# Altium schematic sheet TerminalBlock.SchDoc
size 420 x 297 mm; SheetNumber: 2; SheetTotal: 2
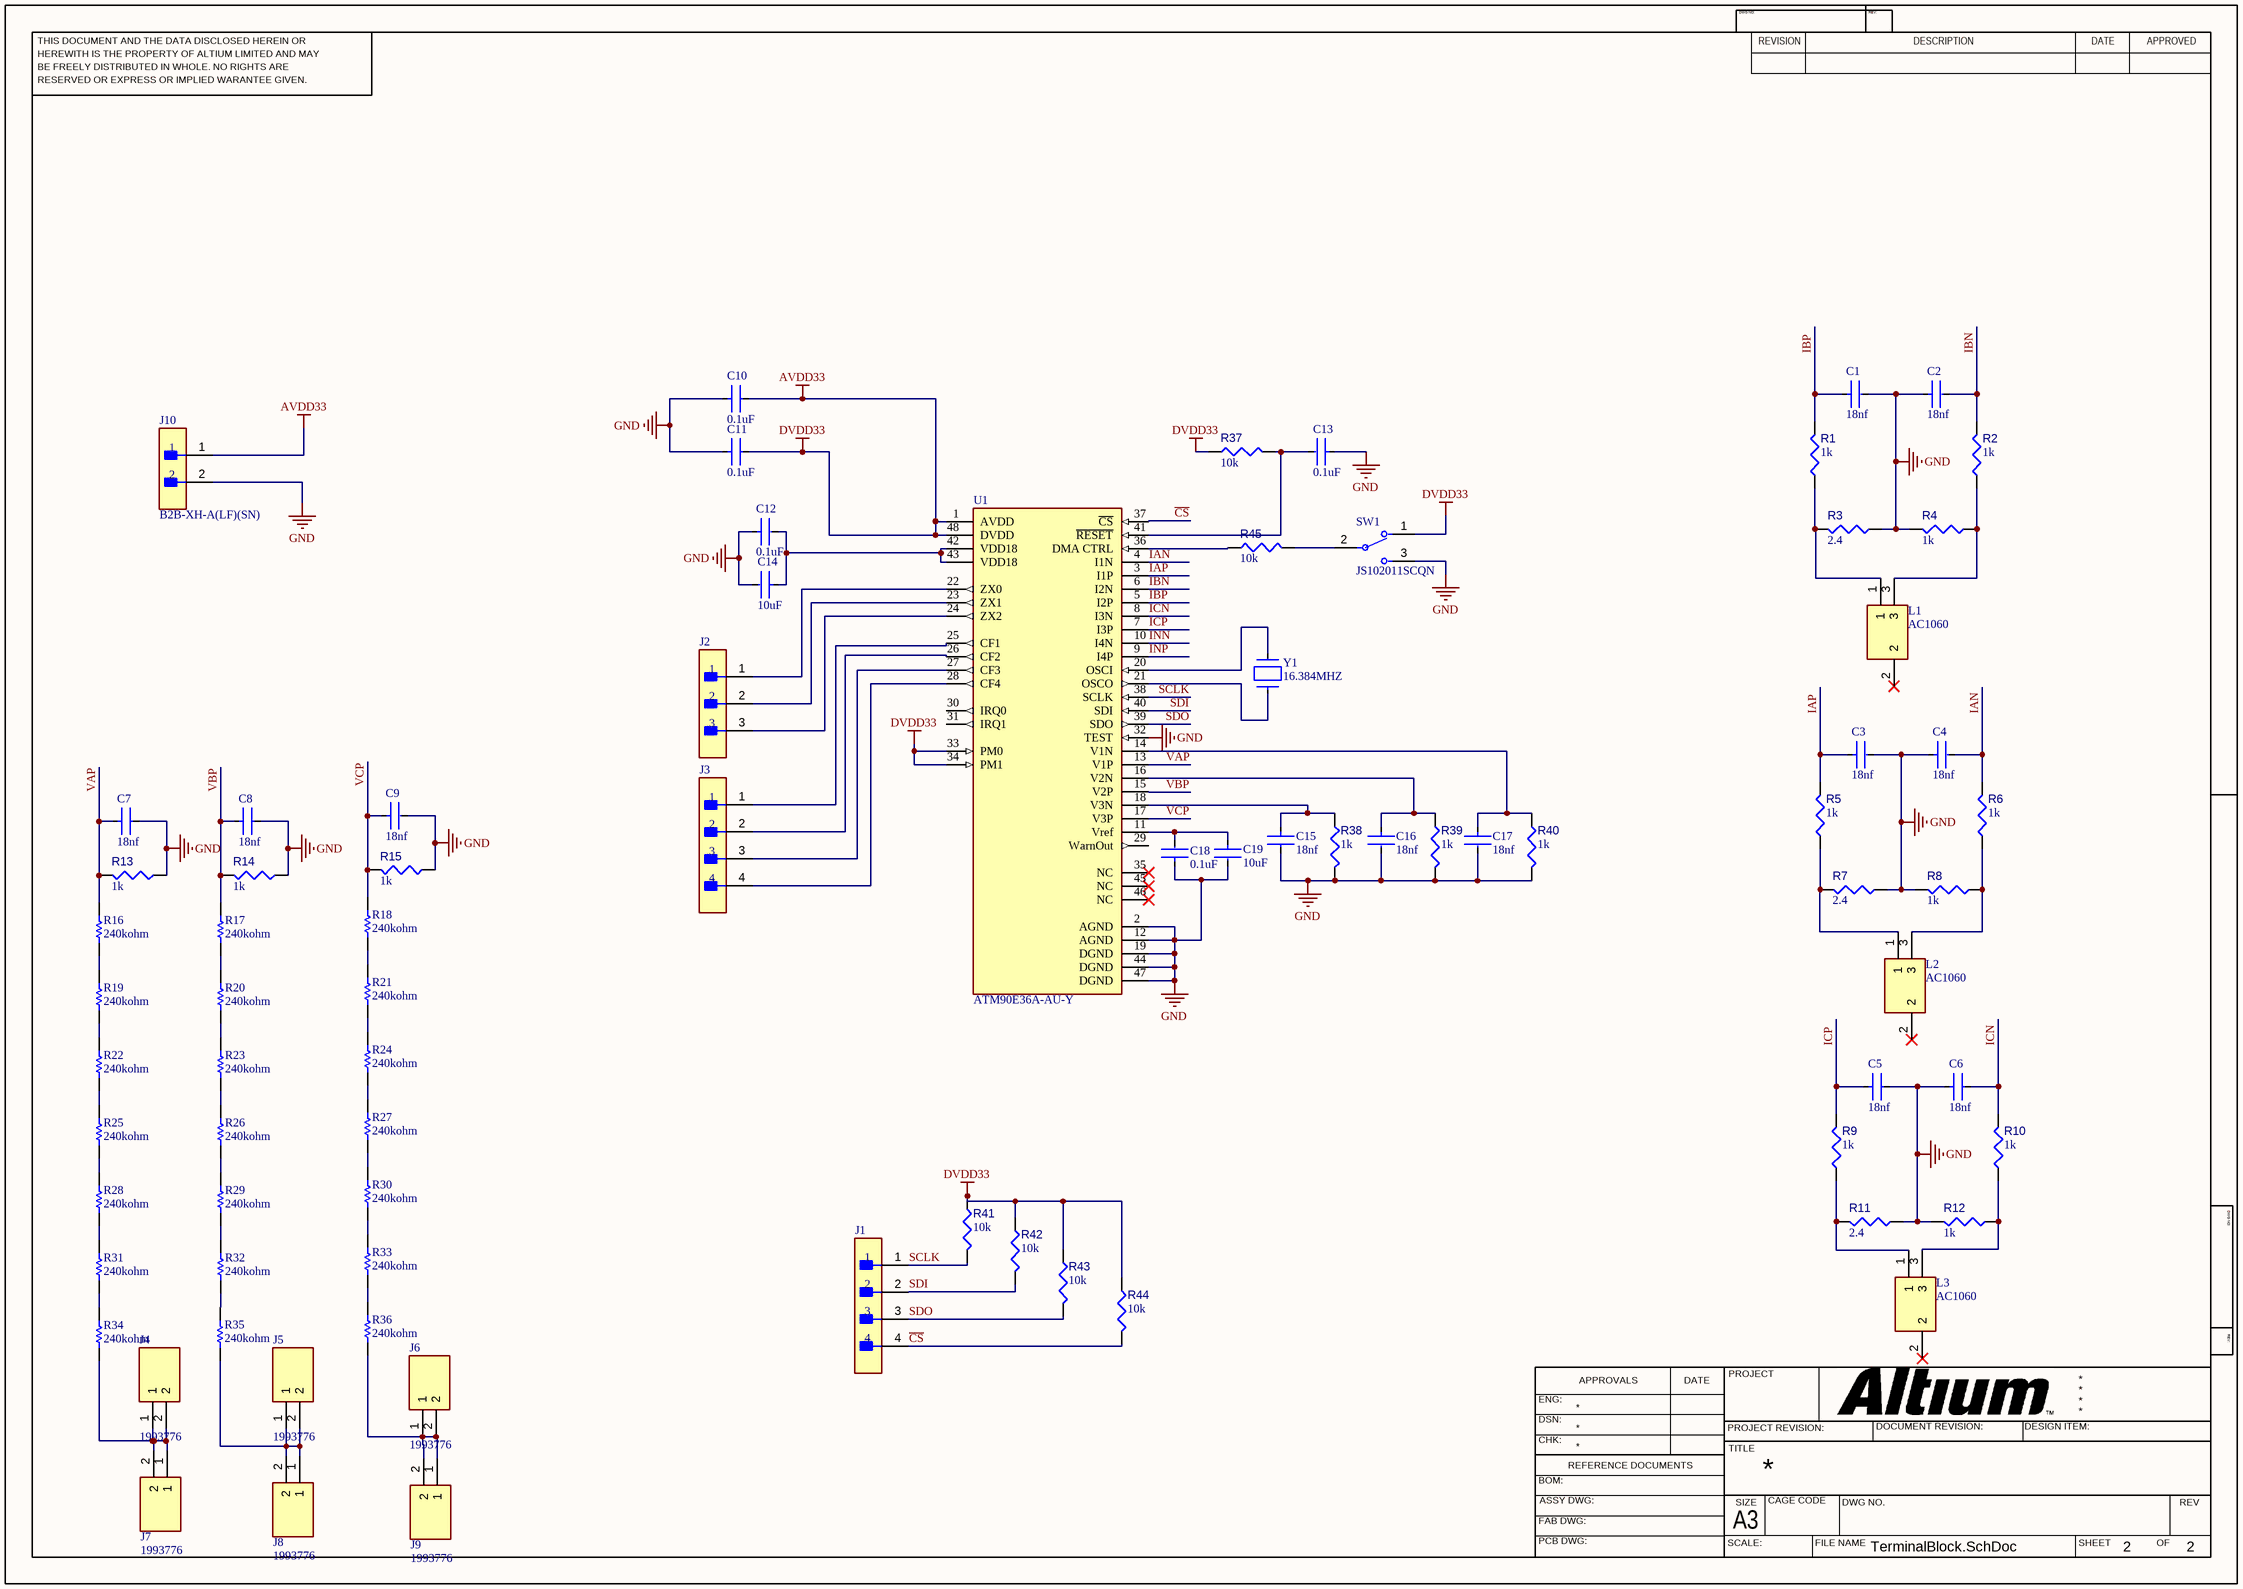
[diagram p0: TerminalBlock.SchDoc]

## Parts
C1  18nf  [FP-C0603C-CF-MFG]
C2  18nf  [FP-C0603C-CF-MFG]
C3  18nf  [FP-C0603C-CF-MFG]
C4  18nf  [FP-C0603C-CF-MFG]
C5  18nf  [FP-C0603C-CF-MFG]
C6  18nf  [FP-C0603C-CF-MFG]
C7  18nf  [FP-C0603C-CF-MFG]
C8  18nf  [FP-C0603C-CF-MFG]
C9  18nf  [FP-C0603C-CF-MFG]
C10  0.1uF  [FP-C0603-CJ-MFG]
C11  0.1uF  [FP-C0603-CJ-MFG]
C12  0.1uF  [FP-C0603-CJ-MFG]
C13  0.1uF  [FP-C0603-CJ-MFG]
C14  10uF  [FP-C0603C106M9PACTU-MFG]
C15  18nf  [FP-C0603C-CF-MFG]
C16  18nf  [FP-C0603C-CF-MFG]
C17  18nf  [FP-C0603C-CF-MFG]
C18  0.1uF  [FP-C0603-CJ-MFG]
C19  10uF  [FP-C0603C106M9PACTU-MFG]
J1  B4B-XH-A(LF)(SN)  [FP-B4B-XH-A_LF_SN-MFG]  (value not drawn)
J2  B3B-XH-A(LF)(SN)  [FP-B3B-XH-A_LF_SN-MFG]  (value not drawn)
J3  B4B-XH-A(LF)(SN)  [FP-B4B-XH-A_LF_SN-MFG]  (value not drawn)
J4  1993776  [1993776]
J5  1993776  [1993776]
J6  1993776  [1993776]
J7  1993776  [1993776]
J8  1993776  [1993776]
J9  1993776  [1993776]
J10  B2B-XH-A(LF)(SN)  [FP-B2B-XH-A_LF_SN-MFG]
L1  AC1060  [AC1060]
L2  AC1060  [AC1060]
L3  AC1060  [AC1060]
R1  value 1k  [RESC1608X55X25ML10T15]  (hidden comment: Resistor 100k +/-1% 0603 100 mW)
R2  value 1k  [RESC1608X55X25ML10T15]  (hidden comment: Resistor 100k +/-1% 0603 100 mW)
R3  value 2.4  [RESC1608X55X25ML10T15]  (hidden comment: Resistor 100k +/-1% 0603 100 mW)
R4  value 1k  [RESC1608X55X25ML10T15]  (hidden comment: Resistor 100k +/-1% 0603 100 mW)
R5  value 1k  [RESC1608X55X25ML10T15]  (hidden comment: Resistor 100k +/-1% 0603 100 mW)
R6  value 1k  [RESC1608X55X25ML10T15]  (hidden comment: Resistor 100k +/-1% 0603 100 mW)
R7  value 2.4  [RESC1608X55X25ML10T15]  (hidden comment: Resistor 100k +/-1% 0603 100 mW)
R8  value 1k  [RESC1608X55X25ML10T15]  (hidden comment: Resistor 100k +/-1% 0603 100 mW)
R9  value 1k  [RESC1608X55X25ML10T15]  (hidden comment: Resistor 100k +/-1% 0603 100 mW)
R10  value 1k  [RESC1608X55X25ML10T15]  (hidden comment: Resistor 100k +/-1% 0603 100 mW)
R11  value 2.4  [RESC1608X55X25ML10T15]  (hidden comment: Resistor 100k +/-1% 0603 100 mW)
R12  value 1k  [RESC1608X55X25ML10T15]  (hidden comment: Resistor 100k +/-1% 0603 100 mW)
R13  value 1k  [RESC1608X55X25ML10T15]  (hidden comment: Resistor 100k +/-1% 0603 100 mW)
R14  value 1k  [RESC1608X55X25ML10T15]  (hidden comment: Resistor 100k +/-1% 0603 100 mW)
R15  value 1k  [RESC1608X55X25ML10T15]  (hidden comment: Resistor 100k +/-1% 0603 100 mW)
R16  240kohm  [RESC1608X55X30NL20T20]
R17  240kohm  [RESC1608X55X30NL20T20]
R18  240kohm  [RESC1608X55X30NL20T20]
R19  240kohm  [RESC1608X55X30NL20T20]
R20  240kohm  [RESC1608X55X30NL20T20]
R21  240kohm  [RESC1608X55X30NL20T20]
R22  240kohm  [RESC1608X55X30NL20T20]
R23  240kohm  [RESC1608X55X30NL20T20]
R24  240kohm  [RESC1608X55X30NL20T20]
R25  240kohm  [RESC1608X55X30NL20T20]
R26  240kohm  [RESC1608X55X30NL20T20]
R27  240kohm  [RESC1608X55X30NL20T20]
R28  240kohm  [RESC1608X55X30NL20T20]
R29  240kohm  [RESC1608X55X30NL20T20]
R30  240kohm  [RESC1608X55X30NL20T20]
R31  240kohm  [RESC1608X55X30NL20T20]
R32  240kohm  [RESC1608X55X30NL20T20]
R33  240kohm  [RESC1608X55X30NL20T20]
R34  240kohm  [RESC1608X55X30NL20T20]
R35  240kohm  [RESC1608X55X30NL20T20]
R36  240kohm  [RESC1608X55X30NL20T20]
R37  value 10k  [RESC1608X55X25ML10T15]  (hidden comment: Resistor 100k +/-1% 0603 100 mW)
R38  value 1k  [RESC1608X55X25ML10T15]  (hidden comment: Resistor 100k +/-1% 0603 100 mW)
R39  value 1k  [RESC1608X55X25ML10T15]  (hidden comment: Resistor 100k +/-1% 0603 100 mW)
R40  value 1k  [RESC1608X55X25ML10T15]  (hidden comment: Resistor 100k +/-1% 0603 100 mW)
R41  value 10k  [RESC1608X55X25ML10T15]  (hidden comment: Resistor 100k +/-1% 0603 100 mW)
R42  value 10k  [RESC1608X55X25ML10T15]  (hidden comment: Resistor 100k +/-1% 0603 100 mW)
R43  value 10k  [RESC1608X55X25ML10T15]  (hidden comment: Resistor 100k +/-1% 0603 100 mW)
R44  value 10k  [RESC1608X55X25ML10T15]  (hidden comment: Resistor 100k +/-1% 0603 100 mW)
R45  value 10k  [RESC1608X55X25ML10T15]  (hidden comment: Resistor 100k +/-1% 0603 100 mW)
SW1  JS102011SCQN  [FP-JS102011SCQN-MFG]
U1  ATM90E36A-AU-Y  [FP-ATM90E36A-AU-Y-MFG]
Y1  16.384MHZ  [FP-ABM2-MFG]

## Nets
AVDD33: C10.2 C11.2 J10.1 R37.2 R41.2 R42.2 R43.2 R44.2 SW1.1 U1.1(AVDD) U1.33(PM0) U1.34(PM1) U1.48(DVDD)  [also labelled DVDD33]
GND: C1.2 C2.1 C3.2 C4.1 C5.2 C6.1 C7.2 C8.2 C9.2 C10.1 C11.1 C12.1 C13.1 C14.2 C15.2 C16.2 C17.2 C18.1 C19.2 J10.2 R3.1 R4.2 R7.1 R8.2 R11.1 R12.2 R13.1 R14.1 R15.1 R38.1 R39.1 R40.1 SW1.3 U1.2(AGND) U1.12(AGND) U1.19(DGND) U1.32(TEST) U1.44(DGND) U1.47(DGND)
~{CS}: J1.4 R44.1 U1.37(~{CS})
IAN: C4.2 R6.2 U1.4(I1N)
IAP: C3.1 R5.2 U1.3(I1P)
IBN: C2.2 R2.2 U1.6(I2N)
IBP: C1.1 R1.2 U1.5(I2P)
ICN: C6.2 R10.2 U1.8(I3N)
ICP: C5.1 R9.2 U1.7(I3P)
INN: U1.10(I4N)
INP: U1.9(I4P)
SCLK: J1.1 R41.1 U1.38(SCLK)
SDI: J1.2 R42.1 U1.40(SDI)
SDO: J1.3 R43.1 U1.39(SDO)
VAP: C7.1 R13.2 R16.2 U1.13(V1P)
VBP: C8.1 R14.2 R17.2 U1.15(V2P)
VCP: C9.1 R15.2 R18.2 U1.17(V3P)
NetC12_2: C12.2 C14.1 U1.42(VDD18) U1.43(VDD18)
NetC13_2: C13.2 R37.1 U1.41(~{RESET})
NetC15_1: C15.1 R38.2 U1.18(V3N)
NetC16_1: C16.1 R39.2 U1.16(V2N)
NetC17_1: C17.1 R40.2 U1.14(V1N)
NetC18_2: C18.2 C19.1 U1.11(Vref)
NetJ2_1: J2.1 U1.22(ZX0)
NetJ2_2: J2.2 U1.23(ZX1)
NetJ2_3: J2.3 U1.24(ZX2)
NetJ3_1: J3.1 U1.25(CF1)
NetJ3_2: J3.2 U1.26(CF2)
NetJ3_3: J3.3 U1.27(CF3)
NetJ3_4: J3.4 U1.28(CF4)
NetJ4_1: J4.1 J4.2 J7.1 J7.2 R34.1
NetJ5_1: J5.1 J5.2 J8.1 J8.2 R35.1
NetJ6_1: J6.1 J6.2 J9.1 J9.2 R36.1
NetL1_1: L1.1 R1.1 R3.2
NetL1_3: L1.3 R2.1 R4.1
NetL2_1: L2.1 R5.1 R7.2
NetL2_3: L2.3 R6.1 R8.1
NetL3_1: L3.1 R9.1 R11.2
NetL3_3: L3.3 R10.1 R12.1
NetR16_1: R16.1 R19.2
NetR17_1: R17.1 R20.2
NetR18_1: R18.1 R21.2
NetR19_1: R19.1 R22.2
NetR20_1: R20.1 R23.2
NetR21_1: R21.1 R24.2
NetR22_1: R22.1 R25.2
NetR23_1: R23.1 R26.2
NetR24_1: R24.1 R27.2
NetR25_1: R25.1 R28.2
NetR26_1: R26.1 R29.2
NetR27_1: R27.1 R30.2
NetR28_1: R28.1 R31.2
NetR29_1: R29.1 R32.2
NetR30_1: R30.1 R33.2
NetR31_1: R31.1 R34.2
NetR32_1: R32.1 R35.2
NetR33_1: R33.1 R36.2
NetR45_1: R45.1 SW1.2(C)
NetR45_2: R45.2 U1.36(DMA_CTRL)
NetU1_20: U1.20(OSCI) Y1.2
NetU1_21: U1.21(OSCO) Y1.1

Not connected (* = marked no-connect by the designer): L1 2*; L2 2*; L3 2*; U1 29(WarnOut) 30(IRQ0) 31(IRQ1) 35(NC)* 45(NC)* 46(NC)*

## Notes on the sheet
- THIS DOCUMENT AND THE DATA DISCLOSED HEREIN OR
- HEREWITH IS THE PROPERTY OF ALTIUM LIMITED AND MAY
- DWG NO:
- REVISION
- REV:
- DESCRIPTION
- DATE
- APPROVED
- BE FREELY DISTRIBUTED IN WHOLE. NO RIGHTS ARE
- RESERVED OR EXPRESS OR IMPLIED WARANTEE GIVEN.
- ENG:
- APPROVALS
- PROJECT
- DSN:
- CHK:
- REFERENCE DOCUMENTS
- PROJECT REVISION:
- TITLE
- DOCUMENT REVISION:
- DESIGN ITEM:
- BOM:
- FAB DWG:
- PCB DWG:
- ASSY DWG:
- SCALE:
- A3
- SIZE
- CAGE CODE
- FILE NAME
- DWG NO.
- SHEET
- OF
- REV

## Library data of the parts
C1-C9 C15-C17 = CMP-1035-02403-3: CAP CER 0.018UF 50V 10% X7R 0603; Manufacturer: KEMET; Manufacturer Part Number: C0603C183K5RACTU; Material: Ceramic; Tolerance: 0.1; Capacitance: 18,000 pF; Temperature Coefficient: 30ppm/°C; Value: 18,000 pF; Automotive Grade: Grade 1; Device Class L3: Ceramic Capacitors; Temperature Characteristic: X7R; ComponentLink2Description: Datasheet; RoHS: TRUE; Package: C0603C-CF; Automotive: Yes; Octopart: https://octopart.com/c0603c183k5ractu-kemet-9138582; Temperature Range Low: -55°C; Height: 0.87mm; Mouser Description: Multilayer Ceramic Capacitors MLCC - SMD/SMT 50volts 18000pF X7R 10%; Temperature: -55°C to +125°C; Digikey Description: CAP CER 0.018UF 50V 10% X7R 0603; Device Class L2: Capacitors; Device Class L1: Passive Components; Temperature Range High: +125°C; Category: Cap; ComponentLink2URL: https://api.kemet.com/component-edge/download/datasheet/C0603C100J5GACAUTO.pdf; Lead Free: Yes; Voltage Rating: 50 V
C10-C13 C18 = CMP-2006-03300-2: CAP CER 0.1UF 50V X7R 0603; Manufacturer Part Number: C0603X104K5RACTU; Manufacturer: Kemet; Capacitance: 100nF; Material: Ceramic; Tolerance: 10%; Value: 100nF; Temperature Coefficient: 15%; Temperature Range High: +125°C; Temperature Range Low: -55°C; Voltage: 50V; ComponentLink2Description: Datasheet; RoHS: TRUE; ComponentLink2URL: https://content.kemet.com/datasheets/KEM_C1013_X7R_FT-CAP_SMD.pdf; Device Class L3: Ceramic Capacitors; Device Class L2: Capacitors; Package: C0603-CJ; Height: 0.95mm; Device Class L1: Passive Components; Temperature Characteristic: X7R; Lead Free: Yes; Digikey Description: CAP CER 0.1UF 50V X7R 0603; Automotive: No; Mouser Description: Capacitor; Ceramic; Cap 0.1uF; Tol+10%; SMT; Flexible Termination; Vol-Rtg 50V; TR; Temperature: -55°C to +125°C; Octopart: https://octopart.com/c0603x104k5ractu-kemet-9145062; Category: Cap; Voltage Rating: 50V; Ipc Land Pattern Name: CAPC16080X80
C14 C19 = CMP-2006-02285-3: CAP CER 10UF 6.3V X5R 0603; Manufacturer Part Number: C0603C106M9PACTU; Manufacturer: Kemet; Material: Ceramic; Temperature Coefficient: 15%; Tolerance: 20%; Category: Cap; Height: 0.9mm; Digikey Description: CAP CER 10UF 6.3V X5R 0603; Mouser Description: In a Pack of 10, KEMET 0603 (1608M) 10µF MLCC 6.3V dc ±20% SMD C0603C106M9PACTU; Voltage Rating: 6.3V; Device Class L2: Capacitors; Temperature Range Low: -55°C; Temperature Characteristic: X5R; ComponentLink2Description: Datasheet; Ipc Land Pattern Name: CAPC16080X80; ComponentLink2URL: http://www.kemet.com/Lists/ProductCatalog/Attachments/19/KEM_C1006_X5R_SMD.pdf; Capacitance: 10uF; Temperature Range High: +85°C; Device Class L3: Ceramic Capacitors; RoHS: TRUE; Automotive: No; Value: 10uF; Temperature: -55°C to +85°C; Device Class L1: Passive Components; Package: C0603C106M9PACTU; Lead Free: Yes; Octopart: https://octopart.com/c0603c106m9pactu-kemet-8375727
J1 J3 = CMP-17439-000250-1: CONN HEADER VERT 4POS 2.5MM; Number of Contacts: 4; Contact Resistance: 20mR; Voltage Rating: 250V; Max Current Rating: 3A; Gender: Male; Wire/Cable Gauge: 22AWG; Mated Stacking Heights: 9.8mm; Insulation Resistance: 1GR; Orientation: Straight; Contact Type: Male Pin; Contact Finish - Mating: TIN; Series: XH; Max Voltage Rating (AC): 250V; Lead Pitch: 2.5mm; Contact Shape: Square; Insulation Color: Natural; Termination: Solder; Lead Free: Lead Free; Voltage Rating (AC): 250V; Number of Rows: 1; Flammability Rating: UL94 V-0; Number of Positions: 4; Max Operating Temperature: 85°C; Package Quantity: 500; Mount: Through Hole; REACH SVHC: No SVHC; Connector Type: Header; Insulation Material: Nylon; Fastening Type: Detent; Min Operating Temperature: -25°C; Housing Color: White; Packaging: Bulk; Contact Plating: Tin; Contact Material: Brass; Max Voltage Rating (DC): 250V; Housing Material: Polyamide; Color: Natural; Material: Polyamide; Pitch: 2.5mm; Depth: 5.75mm; Current Rating: 3A; Length: 12.4mm
J2 = CMP-17439-000014-3: CONN HEADER VERT 3POS 2.5MM; Max Voltage Rating (DC): 250V; Number of Positions: 3; Current Rating: 3A; Gender: Male; Wire/Cable Gauge: 22AWG; Contact Resistance: 20mR; Insulation Resistance: 1GR; Insulation Material: Nylon; Contact Plating: Tin; Depth: 5.75mm; Contact Type: Male Pin; Max Operating Temperature: 85°C; Insulation Color: Natural; Voltage Rating (AC): 250V; Color: Natural; Connector Type: Header; Orientation: Straight; Fastening Type: Detent; Housing Color: White; Min Operating Temperature: -25°C; Termination: Solder; Voltage Rating: 250V; Series: XH; Pitch: 2.5mm; Contact Shape: Square; Number of Rows: 1; Lead Free: Lead Free; Packaging: Bulk; Mount: Through Hole; Flammability Rating: UL94 V-0; Max Voltage Rating (AC): 250V; REACH SVHC: No SVHC; Housing Material: Polyamide; Contact Material: Brass; Lead Pitch: 2.5mm; Contact Finish - Mating: TIN; Length: 9.9mm; Max Current Rating: 3A; Number of Contacts: 3
J4-J9 = 1993776: Connector; Manufacturer_Name: Phoenix Contact; Datasheet Link: http://www.phoenixcontact.com/de/produkte/1993776/pdf; Height: 31mm; Manufacturer_Part_Number: 1993776; Mouser Part Number: 651-1993776; Mouser Price/Stock: https://www.mouser.co.uk/ProductDetail/Phoenix-Contact/1993776?qs=eiqBpq341KVDuanaesYp0g%3D%3D; Arrow Part Number: 1993776; Arrow Price/Stock: https://www.arrow.com/en/products/1993776/phoenix-contact?region=nac
J10 = CMP-2000-05888-3: CONN HEADER VERT 2POS 2.5MM; Current Rating: 3A; Voltage Rating: 250V; Number of Contacts: 2; Contact Resistance: 20mR; Wire/Cable Gauge: 22AWG; Insulation Resistance: 1GR; Connector Type: Male Pin; Packaging: Bulk; Contact Material: Brass; Lead Free: Lead Free; Orientation: Straight; Contact Plating: Tin; Max Current Rating: 3A; Termination: Solder; Fastening Type: Detent; Depth: 5.75mm; Housing Material: Polyamide; REACH SVHC: No SVHC; Series: XH; Voltage Rating (AC): 250V; Number of Positions: 2; Color: Natural; Contact Type: Male Pin; Max Voltage Rating (DC): 250V; Pitch: 2.5mm; Lead Pitch: 2.5mm; Mount: Through Hole; Max Operating Temperature: 85°C; Length: 7.4mm; Max Voltage Rating (AC): 250V; Min Operating Temperature: -25°C; Number of Rows: 1; Housing Color: White
L1-L3 = AC1060: Inductor; Manufacturer_Name: Talema Group LLC; Datasheet Link: https://datasheet.datasheetarchive.com/originals/distributors/Datasheets_SAMA/a09f01302cd5774f4eb110e0a09641df.pdf; Height: 38.1mm; Manufacturer_Part_Number: AC1060
R1-R15 R37-R45 = CMP-009-00023-5: Chip Resistor, 100 KOhm, +/- 1%, 0.1 W, -55 to 155 degC, 0603 (1608 Metric); Voltage Rating: 50V; Power: 100mW; Max Operating Temperature: 155°C; RoHS Compliant: True; Tolerance: 1%; Pins: 2; Case/Package: 0603; Mounting Technology: SM; Min Operating Temperature: -55°C
R16-R36 = CMP-2000-00001-1: Part Number: ERA3AEB244V; Manufacturer: Panasonic
SW1 = CMP-10038-000023-1: SWITCH SLIDE SPDT 300MA 6V; Electrical Life: 5000Cycles; Actuator Type: Standard; Contact Resistance: 70mR; Actuator Material: Nylon; Max Voltage Rating (DC): 30V; Actuator Length: 2mm; Switch Function: On-On; Actuator Color: Black; Radiation Hardening: No; Throw Configuration: SPDT; Depth: 7.5mm; Case/Package: SMD/SMT; Package Quantity: 4000; Min Operating Temperature: -40°C; Length: 8.5mm; Current Rating: 300mA; Mount: Surface Mount; Voltage Rating (DC): 6V; RoHS Compliant: Yes; Orientation: Straight; Housing Material: Nylon; Contact Plating: Silver; Max Operating Temperature: 85°C; Packaging: Tape and Reel; Switch Travel: 2mm; Max Current Rating: 300mA; Contact Material: Copper Alloy; Series: JS; Termination: Gull Wing
U1 = CMP-06317-000017-1: 48-TQFP, IND TEMP, 1.8V/3V, TRAY; RoHS Compliant: Yes
Y1 = CMP-27762-013693-1: Crystal 16.384MHz ±30ppm 18pF SMD-2 8mm x 4.5mm; ESR (Equivalent Series Resistance): 50R; Length: 8mm; Max Operating Temperature: 85°C; Min Operating Temperature: -40°C; Radiation Hardening: No; Load Capacitance: 18pF; Tolerance: 30ppm; Termination: SMD/SMT; Number of Pins: 2; Series: ABM2; Frequency Stability: 30ppm; Height: 0.063inch; Width: 4.5mm; Depth: 4.5mm; Frequency: 16.384MHz; Frequency Tolerance: 30ppm; Package Quantity: 1000; Case/Package: CSMD; Resistor Type: Ceramic; RoHS Compliant: Yes; Mount: Surface Mount; Packaging: Tape and Reel